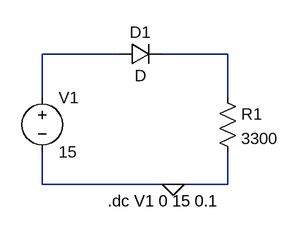
[diagram p0: schematic 2022023_2.asc]
2022023_2.asc, the LTspice schematic file:
Version 4
SHEET 1 880 680
WIRE 160 80 48 80
WIRE 320 80 224 80
WIRE 48 144 48 80
WIRE 320 144 320 80
WIRE 48 272 48 224
WIRE 240 272 48 272
WIRE 320 272 320 224
WIRE 320 272 240 272
FLAG 240 272 0
SYMBOL voltage 48 128 R0
WINDOW 123 0 0 Left 0
WINDOW 39 0 0 Left 0
SYMATTR InstName V1
SYMATTR Value 15
SYMBOL diode 160 96 R270
WINDOW 0 32 32 VTop 2
WINDOW 3 0 32 VBottom 2
SYMATTR InstName D1
SYMBOL res 304 128 R0
SYMATTR InstName R1
SYMATTR Value 3300
TEXT 144 296 Left 2 !.dc V1 0 15 0.1

The netlist it stands for:
* 2022023_2.asc
V1 N001 0 15
D1 N001 N002 D
R1 N002 0 3300
.model D D
.lib standard.dio
.dc V1 0 15 0.1
.backanno
.end